# Altium project n-baseU68.PrjPcb
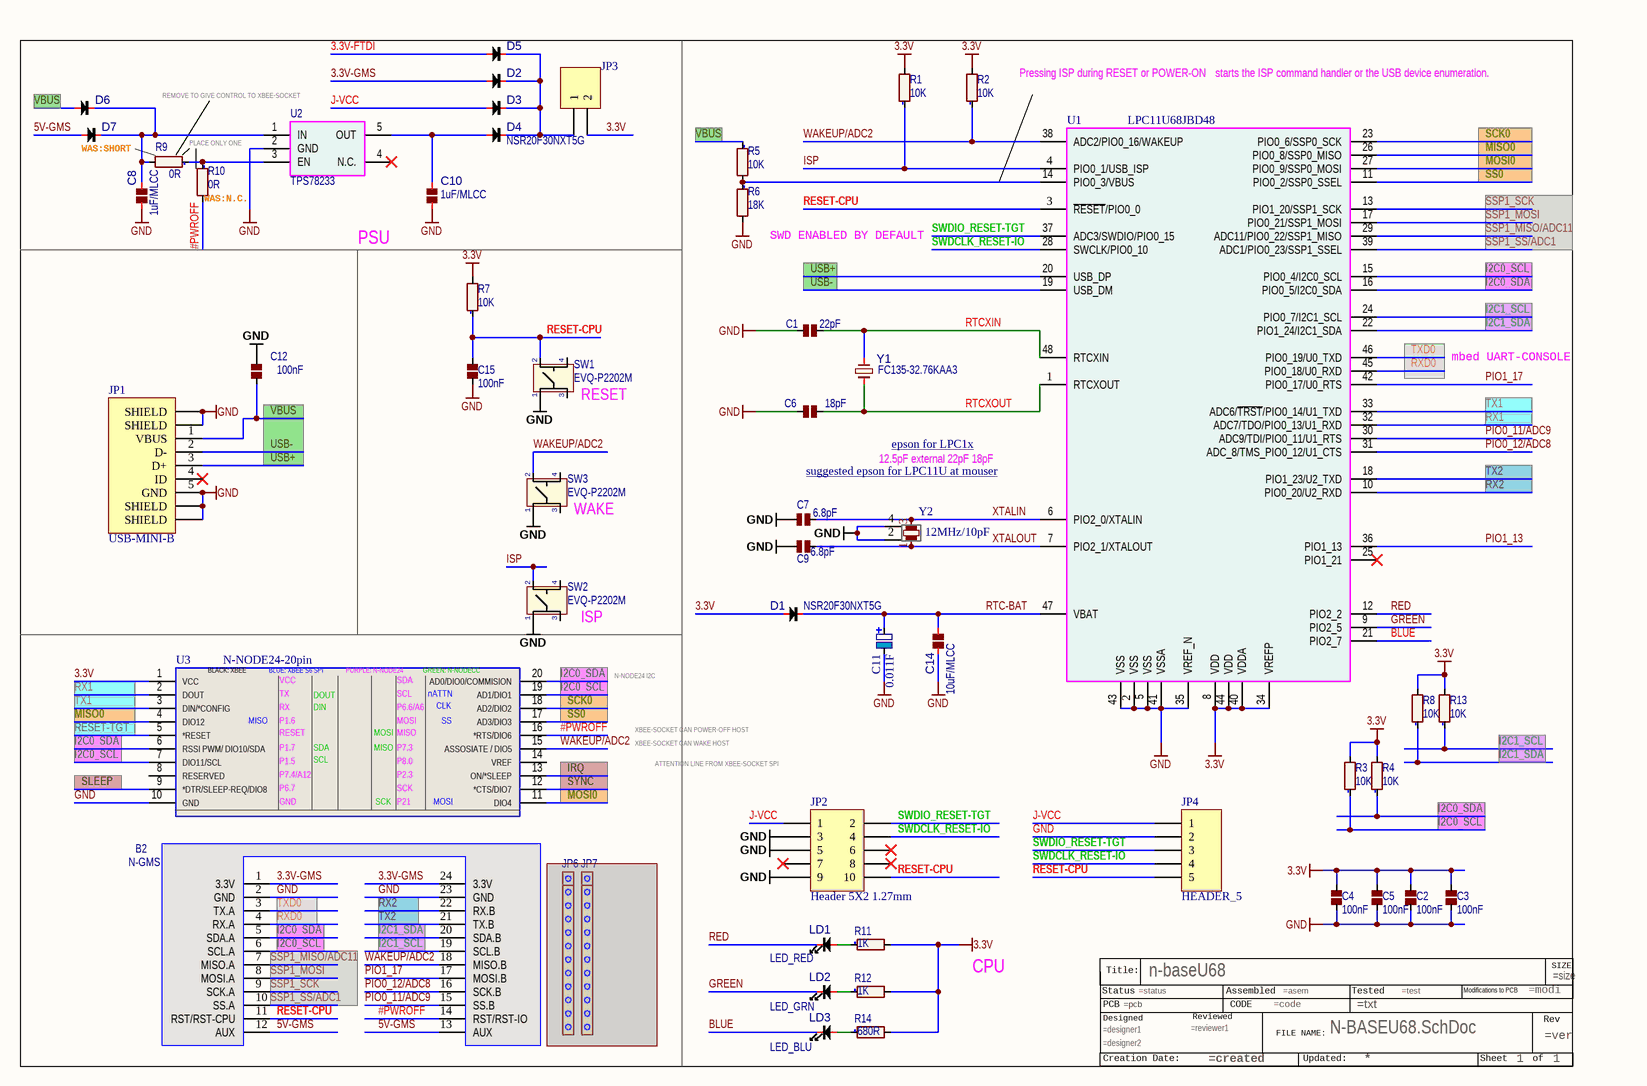
[diagram p0: N-BASEU68.SchDoc]
OrderQty: 25; prj: n-baseU68
1 sheet, 54 parts. Net scope: global (net labels, ports and power ports of the same name join across sheets).
Board file: N-BASEU68.PcbDoc

## Sheet N-BASEU68.SchDoc
size A4; DocumentNumber: 1; SheetNumber: 1; SheetTotal: 1; PageSetup: Record=PageOptions|CenterHorizontal=True|CenterVertical=True|PrintScale=0.05|XCorrection=1.00|YCorrection=1.00|PrintKind=0|BorderSize=5000000|LeftOffset=0|BottomOffset=0|Orientation=2|PaperLength=1000|PaperWidth=1000|Scale=100|PaperSource=7|PrintQuality=-3|MediaType=1|DitherType=10|PrintScaleMode=1|PaperKind=12mm|PaperIndex=126

### Parts
?*??  FILE_NAME: N-BASEU68.SchDoc  PAGE NUMPER: 1  pr: n-baseU68  (hidden comment: TITLEBLOCK3)  (graphical)
B2  N-GMS  [N-GMS]
C1  22pF  [0603_cap]
C2  100nF  [0603_cap]
C3  100nF  [0603_cap]
C4  100nF  [0603_cap]
C5  100nF  [0603_cap]
C6  18pF  [0603_cap]
C7  6.8pF  [0603_cap]
C8  1uF/MLCC  [0603_CAP]
C9  6.8pF  [0603_cap]
C10  1uF/MLCC  [0603_CAP]
C11  0.011F  [SUPERCAP  PAS3225P3R3113]
C12  100nF  [0603_cap]
C14  10uF/MLCC  [0603_CAP]
C15  100nF  [0603_cap]
D1  NSR20F30NXT5G  [0603_DIODE-CDSU101A]
D2  NSR20F30NXT5G  [0603_DIODE-CDSU101A]  (value not drawn)
D3  NSR20F30NXT5G  [0603_DIODE-CDSU101A]  (value not drawn)
D4  NSR20F30NXT5G  [0603_DIODE-CDSU101A]
D5  NSR20F30NXT5G  [0603_DIODE-CDSU101A]  (value not drawn)
D6  NSR20F30NXT5G  [0603_DIODE-CDSU101A]  (value not drawn)
D7  NSR20F30NXT5G  [0603_DIODE-CDSU101A]  (value not drawn)
JP1  USB-MINI-B  [USB-MINI-B-HIR-UX60A-MB-5ST]
JP2  Header 5X2 1.27mm  [2x5-1.27mm-HARWIN-855-M50-3600542]
JP3  HEADER-2  [1X02]  (value not drawn)
JP4  HEADER_5  [1X05]
JP6  HEADER 9  [1X12-NOSILK]  (value not drawn)  (masked out: inside a compile mask, not in the netlist)
JP7  HEADER 9  [1X12-NOSILK]  (value not drawn)  (masked out: inside a compile mask, not in the netlist)
LD1  LED_RED  [0603_LED_RED]
LD2  LED_GRN  [0603_LED_GRN]
LD3  LED_BLU  [0603_LED_BLU]
R1  10K  [0603_res]
R2  10K  [0603_res]
R3  10K  [0603_res]
R4  10K  [0603_res]
R5  10K  [0603_res]
R6  18K  [0603_res]
R7  10K  [0603_res]
R8  10K  [0603_res]
R9  0R  [0603_res]
R10  0R  [0603_res]
R11  1K  [0603_res]
R12  1K  [0603_res]
R13  10K  [0603_res]
R14  680R  [0603_res]
SW1  EVQ-P2202M  [BUTTON_4.7x3.5mm]
SW2  EVQ-P2202M  [BUTTON_4.7x3.5mm]
SW3  EVQ-P2202M  [BUTTON_4.7x3.5mm]
U1  LPC11U68JBD48  [SOT313-2_V]
U2  TPS78233  [SOT23-5_0.95mm-NOSILK]
U3  N-NODE24-20pin  [N-NODE24-20pins]
Y1  FC135-32.76KAA3  [CRYSTAL-3.2x1.5]
Y2  12MHz/10pF  [CRY-SMD4-EPSON-FA238V]

### Nets
3.3V: C2.1 C3.1 C4.1 C5.1 D1.1 JP3.2 R1.2 R2.2 R3.2 R4.2 R7.2 R8.2 R11.2 R12.2 R13.2 R14.2 U1.8(VDD) U1.34(VREFP) U1.40(VDDA) U1.44(VDD) U3.1(VCC)
GND: B2.2(GND) B2.23(GND) C1.2 C2.2 C3.2 C4.2 C5.2 C6.2 C7.2 C8.1 C9.2 C10.1 C11.2 C12.1 C14.1 C15.2 JP1.5(GND) JP1.6(SHIELD) JP1.7(SHIELD) JP1.8(SHIELD) JP1.9(SHIELD) JP2.3 JP2.5 JP2.9 JP4.2 R6.2 SW1.1 SW2.1 SW3.1 U1.2(VSS) U1.5(VSS) U1.35(VREF_N) U1.41(VSSA) U1.43(VSS) U2.2(GND) U3.10(GND) Y2.2 Y2.4
3.3V-FTDI: D5.1
3.3V-GMS: B2.1(3.3V) B2.24(3.3V) D2.1
5V-GMS: B2.12(AUX) B2.13(AUX) D7.1
#PWROFF: B2.14(RST/RST-IO) R10.2 U3.16(*RTS/DIO6)
BLUE: LD3.2 U1.21(PIO2_7)
GREEN: LD2.2 U1.9(PIO2_5)
I2C0_SCL: B2.6(SCL.A) R3.1 U1.15(PIO0_4/I2C0_SCL) U3.7(DIO11/SCL) U3.19(AD1/DIO1)
I2C0_SDA: B2.5(SDA.A) R4.1 U1.16(PIO0_5/I2C0_SDA) U3.6(RSSI_PWM/_DIO10/SDA) U3.20(AD0/DIO0/COMMISION)
I2C1_SCL: B2.19(SCL.B) R13.1 U1.24(PIO0_7/I2C1_SCL)
I2C1_SDA: B2.20(SDA.B) R8.1 U1.22(PIO1_24/I2C1_SDA)
IRQ: U3.13(ON/*SLEEP)
ISP: R1.1 SW2.2 U1.4(PIO0_1/USB_ISP)
J-VCC: D3.1 JP2.1 JP4.1
MISO0: U1.26(PIO0_8/SSP0_MISO) U3.4(DIO12)
MOSI0: U1.27(PIO0_9/SSP0_MOSI) U3.11(DIO4)
PIO0_11/ADC9: B2.15(SS.B) U1.30(ADC9/TDI/PIO0_11/U1_RTS)
PIO0_12/ADC8: B2.16(SCK.B) U1.31(ADC_8/TMS_PIO0_12/U1_CTS)
PIO1_13: U1.36(PIO1_13)
PIO1_17: B2.17(MOSI.B) U1.42(PIO0_17/U0_RTS)
RED: LD1.2 U1.12(PIO2_2)
RESET-CPU: B2.11(RST/RST-CPU) C15.1 JP2.10 JP4.5 R7.1 SW1.2 U1.3(~{RESET}/PIO0_0)
RESET-TGT: U3.5(*RESET)
RTC-BAT: C11.1 C14.2 D1.2 U1.47(VBAT)
RTCXIN: C1.1 U1.48(RTCXIN) Y1.1
RTCXOUT: C6.1 U1.1(RTCXOUT) Y1.2
RX1: U1.32(ADC7/TDO/PIO0_13/U1_RXD) U3.2(DOUT)
RX2: B2.22(RX.B) U1.10(PIO0_20/U2_RXD)
RXD0: B2.4(RX.A) U1.45(PIO0_18/U0_RXD)
SCK0: U1.23(PIO0_6/SSP0_SCK) U3.18(AD2/DIO2)
SLEEP: U3.9(*DTR/SLEEP-REQ/DIO8)
SS0: U1.11(PIO0_2/SSP0_SSEL) U3.17(AD3/DIO3)
SSP1_MISO/ADC11: B2.7(MISO.A) U1.29(ADC11/PIO0_22/SSP1_MISO)
SSP1_MOSI: B2.8(MOSI.A) U1.17(PIO0_21/SSP1_MOSI)
SSP1_SCK: B2.9(SCK.A) U1.13(PIO1_20/SSP1_SCK)
SSP1_SS/ADC1: B2.10(SS.A) U1.39(ADC1/PIO0_23/SSP1_SSEL)
SWDCLK_RESET-IO: JP2.4 JP4.4 U1.28(SWCLK/PIO0_10)
SWDIO_RESET-TGT: JP2.2 JP4.3 U1.37(ADC3/SWDIO/PIO0_15)
SYNC: U3.12(*CTS/DIO7)
TX1: U1.33(ADC6/~{TRST}/PIO0_14/U1_TXD) U3.3(DIN/*CONFIG)
TX2: B2.21(TX.B) U1.18(PIO1_23/U2_TXD)
TXD0: B2.3(TX.A) U1.46(PIO0_19/U0_TXD)
USB+: JP1.3(D+) U1.20(USB_DP)
USB-: JP1.2(D-) U1.19(USB_DM)
VBUS: C12.2 D6.1 JP1.1(VBUS) R5.1
WAKEUP/ADC2: B2.18(MISO.B) R2.1 SW3.2 U1.38(ADC2/PIO0_16/WAKEUP) U3.15(ASSOSIATE_/_DIO5)
XTALIN: C7.1 U1.6(PIO2_0/XTALIN) Y2.3
XTALOUT: C9.1 U1.7(PIO2_1/XTALOUT) Y2.1
NetC8_2: C8.2 D6.2 D7.2 R9.2 U2.1(IN)
NetC10_2: C10.2 D4.1 U2.5(OUT)
NetD2_2: D2.2 D3.2 D4.2 D5.2 JP3.1
NetLD1_1: LD1.1 R11.1
NetLD2_1: LD2.1 R12.1
NetLD3_1: LD3.1 R14.1
NetR5_2: R5.2 R6.1 U1.14(PIO0_3/VBUS)
NetR9_1: R9.1 R10.1 U2.3(EN)

Not connected (* = marked no-connect by the designer): ?*?? ?1; JP1 4(ID)*; JP2 6* 7* 8*; SW1 3 4; SW2 3 4; SW3 3 4; U1 25(PIO1_21)*; U2 4(N.C.)*; U3 8(RESERVED) 14(VREF)

### Notes on the sheet
- Pressing ISP during RESET or POWER-ON
- starts the ISP command handler or the USB device enumeration.
- (near D7) WAS:SHORT
- (near U2) REMOVE TO GIVE CONTROL TO XBEE-SOCKET
- PLACE ONLY ONE
- (near R10) WAS:N.C.
- PSU
- (near R6) SWD ENABLED BY DEFAULT
- (near SW1) RESET
- mbed UART-CONSOLE
- suggested epson for LPC11U at mouser <http://www.mouser.ie/ProductDetail/Epson-Timing/FC-135-327680KA-A3/?qs=sGAEpiMZZMsBj6bBr9Q9aZLqXgWtLYAXgtkp1R7gwzo%3d>
- (near U1) 12.5pF external 22pF 18pF
- epson for LPC1x <http://www5.epsondevice.com/en/quartz/tech/c_design/nxp/lpc1x.html>
- (near SW3) WAKE
- (near SW2) ISP
- N-NODE24 I2C
- XBEE-SOCKET CAN WAKE HOST
- XBEE-SOCKET CAN POWER-OFF HOST
- ATTENTION LINE FROM XBEE-SOCKET SPI
- CPU
- (in symbol N-NODE24-20pin) BLACK: XBEE; BLUE: XBEE S6 SPI; PURPLE: N-NODE24; GREEN: N-NODECC; SDA; TX; SCL; nATTN; RX; DIN; P6.6/A6; CLK; MISO; P1.6; MOSI; SS; RESET; P1.7; P7.3; P1.5; P8.0; P7.4/A12; P2.3; P6.7; SCK; P21
- (in symbol TITLEBLOCK3) SIZE; Title:; Status; Assembled; Tested; Modifications to PCB; PCB; CODE; Designed; Reviewed; Rev; FILE NAME:; Creation Date:; Updated:; Sheet; of

### Library data of the parts
B2 = N-GMS: Divider: 1
C1 = C: CAPACITOR; Divider: 1; S.Description: Multilayer Ceramic Capacitors MLCC - SMD/SMT 0603 22pF 50volts C0G 5%; Supplier 1: Mouser; Supplier Part Number 1: 81-GRM39C220J50
C2-C5 C12 = C: CAPACITOR; S.Description: Multilayer Ceramic Capacitors MLCC - SMD/SMT 50volts 0.1uF 10% X7R; Divider: 1; Supplier 1: Mouser; Supplier Part Number 1: 581-06035C104KAT2A
C6 = C: CAPACITOR; Divider: 1; S.Description: Multilayer Ceramic Capacitors MLCC - SMD/SMT 0603 18pF 50volts C0G 5%; Supplier 1: Mouser; Supplier Part Number 1: 810-C1608C0G1H180J
C7 C9 = C: CAPACITOR; Divider: 1; S.Description: Multilayer Ceramic Capacitors MLCC - SMD/SMT 200volts 6.8pF ULTRA LOW ESR; Supplier 1: Mouser; Supplier Part Number 1: 581-06032U6R8BAT2A
C8 C10 = C: CAPACITOR; Divider: 1; S.Description: Multilayer Ceramic Capacitors MLCC - SMD/SMT 0603 1.0uF 16volts X7R 10%; Supplier 1: Mouser; Supplier Part Number 1: 81-GCM188R71C105K64D
C11 = CP_SUPERCAP: Divider: 1; S.Description: Supercapacitors / Ultracapacitors SUPER CAP 3.3V 0.011F; Supplier 1: Mouser; Supplier Part Number 1: 963-PAS3225P3R3113
C14 = C: CAPACITOR; Divider: 1; S.Description: Multilayer Ceramic Capacitors MLCC - SMD/SMT 0603 10uF 10volts X5R + - 10%; Supplier 1: Mouser; Supplier Part Number 1: 81-GRM188R61A106KE9D
C15 = C: CAPACITOR; Divider: 1; S.Description: Multilayer Ceramic Capacitors MLCC - SMD/SMT 50volts 0.1uF 10% X7R; Supplier 1: Mouser; Supplier Part Number 1: 581-06035C104KAT2A
D1 = DIODE: Divider: 1; S.Description: Schottky Diodes & Rectifiers 0603 FC SCHOTTKY DIODES; Supplier 1: Mouser; Supplier Part Number 1: 863-NSR20F30NXT5G
D2-D7 = DIODE: S.Description: Schottky Diodes & Rectifiers 0603 FC SCHOTTKY DIODES; Divider: 1; Supplier 1: Mouser; Supplier Part Number 1: 863-NSR20F30NXT5G
JP1 = USB-MINI-B: S.Description: USB Connectors MINI B RECEPT RA SMT W/O POST; Divider: 1; Supplier 1: Mouser; Supplier Part Number 1: 798-UX60A-MB-5ST
JP2 = Header 5X2: Header, 5-Pin, Dual row; S.Description: Headers & Wire Housings 5+5 DIL PIN HDR SMT Au/Sn; Divider: 1; Supplier 1: Mouser; Supplier Part Number 1: 855-M50-3600542
JP3 = HEADER-2: Divider: 1
JP4 = HEADER_5: Divider: 1
JP6 JP7 = HDR12: Divider: 0.25; S.Description: Headers & Wire Housings 50P SINGLE ROW; Supplier 1: Mouser; Supplier Part Number 1: 571-5-825433-0
LD1 = LED: Divider: 1; S.Description: Standard LEDs - SMD Super Red, 630nm 17mcd, 2mA; Supplier 1: Mouser; Supplier Part Number 1: 720-LSL29K-G1J2-1-Z
LD2 = LED: Divider: 1; S.Description: Standard LEDs - SMD Green, 570nm 10mcd, 2mA; Supplier 1: Mouser; Supplier Part Number 1: 720-LGL29KF2J124Z
LD3 = LED: Divider: 1; S.Description: Standard LEDs - SMD Blue, 470nm 45mcd, 5mA; Supplier 1: Mouser; Supplier Part Number 1: 720-LBQ39GL2N2351
R1 R2 R7 = R: RESISTOR; Divider: 1; S.Description: Thick Film Resistors - SMD 0603 10Kohms 1% Tol; Supplier 1: Mouser; Supplier Part Number 1: 667-ERJ-3EKF1002V
R3-R5 R8 R13 = R: RESISTOR; S.Description: Thick Film Resistors - SMD 0603 10Kohms 1% Tol; Divider: 1; Supplier 1: Mouser; Supplier Part Number 1: 667-ERJ-3EKF1002V
R6 = R: RESISTOR; Divider: 1; S.Description: Thick Film Resistors - SMD 0603 1.8Kohms 5% Tol; Supplier 1: Mouser; Supplier Part Number 1: 667-ERJ-3GEYJ182V
R9 R10 = R: RESISTOR; Divider: 1; S.Description: Thick Film Resistors - SMD 0603 Zero Ohms; Supplier 1: Mouser; Supplier Part Number 1: 667-ERJ-3GEY0R00V
R11 R12 = R: RESISTOR; Divider: 1; S.Description: Thick Film Resistors - SMD 0603 1Kohms 1% Tol; Supplier 1: Mouser; Supplier Part Number 1: 667-ERJ-3EKF1001V
R14 = R: RESISTOR; Divider: 1; S.Description: Thick Film Resistors - SMD 1/10watt 680ohms 1%; Supplier 1: Mouser; Supplier Part Number 1: 71-CRCW0603-680-E3
SW1-SW3 = BUTTON_TACT: BUTTON TACTILE; S.Description: Tactile Switches 4.7x3.5mm SMD Light Touch Switch; Divider: 1; Supplier 1: Mouser; Supplier Part Number 1: 667-EVQ-P2202M
U1 = LPC11U68JBD48_1: S.Description: ARM Microcontrollers - MCU LPC11U68JBD48/LQFP48/STANDARD; Divider: 1; Supplier 1: Mouser; Supplier Part Number 1: 771-LPC11U68JBD48E
U2 = NCP702N: S.Description: LDO Voltage Regulators Sgl Fixed Out LDO 150mA,1uA Quies Crnt; Divider: 1; Supplier 1: Mouser; Supplier Part Number 1: 595-TPS78233DDCR
U3 = N-NODE24-20pin: Divider: 1
Y1 = XTAL: CRYSTAL; Divider: 1; S.Description: Crystals 32.768KHz 20ppm 12.5pF -40C -85C; Supplier 1: Mouser; Supplier Part Number 1: 732-FC135-32.76KAA3
Y2 = XTAL_4PINS: CRYSTAL; Divider: 1; S.Description: Crystals 12.000MHz 10pF 30ppm -20C +70C; Supplier 1: Mouser; Supplier Part Number 1: 815-ABM8G-12-B4Y-T
?*?? = TITLEBLOCK3: size: =size; CREATION DATE: =created; UPDATED: *; PAGE COUNT: 1; VERSION: =ver; ASSEMBLY: =asem; MODIFICATIONS TO OPERATE: =modi; TESTED: =test; PCB: =pcb; STATUS: =status; CODE: =code; TEXT: =txt; designer1: =designer1; designer2: =designer2; reviewer1: =reviewer1